# Altium schematic sheet ArduinoUnoQ.SchDoc
size A4; SheetNumber: 1; SheetTotal: 1
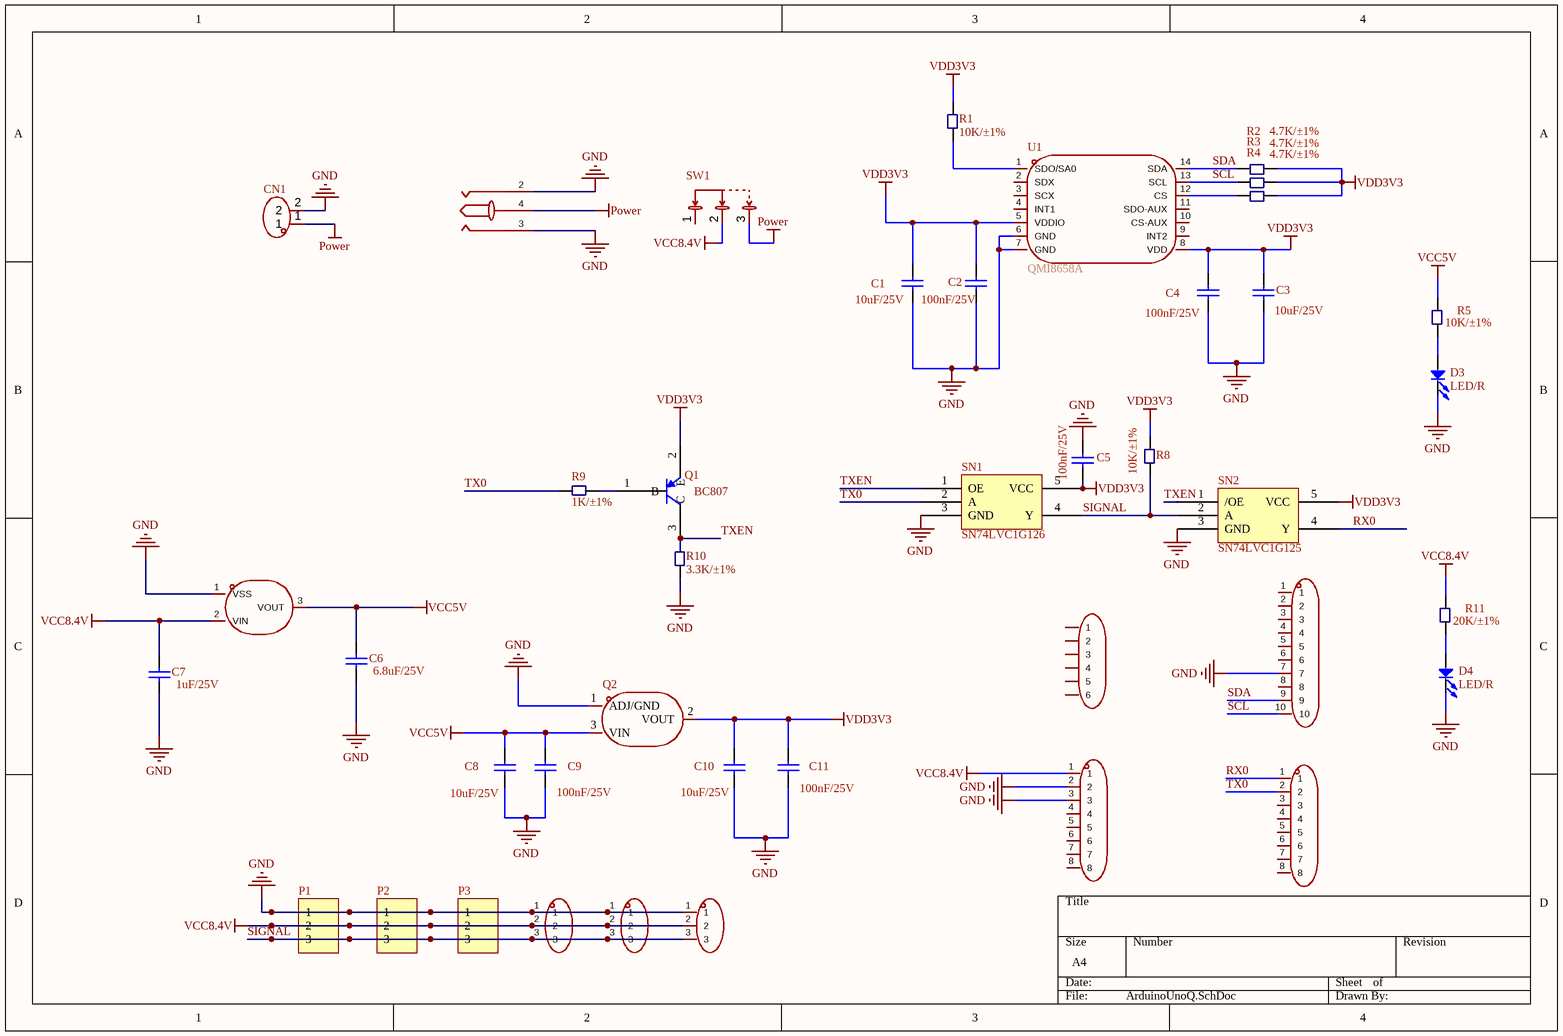
[diagram p0: ArduinoUnoQ.SchDoc]

## Parts
C1  10uF/25V  [C0603]
C2  100nF/25V  [C0603]
C3  10uF/25V  [C0603]
C4  100nF/25V  [C0603]
C5  100nF/25V  [C0603]
C6  6.8uF/25V  [C0603]
C7  1uF/25V  [C0603]
C8  10uF/25V  [C0603]
C9  100nF/25V  [C0603]
C10  10uF/25V  [C0603]
C11  100nF/25V  [C0603]
CN1  ZX-XH2.54-2PWZ  [CONN-TH_2P-P2.50_ZX-XH2.54-2PWZ]  (value not drawn)
D3  LED/R  [D_SOD_523]
D4  LED/R  [D_SOD_523]
DC1  kh-dc-007b-2.1g  [DC-IN-TH_KH-DC-007B-2.1G]  (value not drawn)
H1  pz254v-11-06p  [HDR-TH_6P-P2.54-V-M-1]  (value not drawn)
H2  pz254v-11-10p  [HDR-TH_10P-P2.54-V-M]  (value not drawn)
H3  pz254v-11-08p  [HDR-TH_8P-P2.54-V-M]  (value not drawn)
H4  pz254v-11-08p  [HDR-TH_8P-P2.54-V-M]  (value not drawn)
P1  Header 3  [MX 1.25-WI-3P]  (value not drawn)
P2  Header 3  [MX 1.25-WI-3P]  (value not drawn)
P3  Header 3  [MX 1.25-WI-3P]  (value not drawn)
Q1  BC807  [SOT-23-3]
Q2  AMS1117-3.3V  [SOT-89-3_L4.5-W2.5-P1.50-LS4.2-BR]  (value not drawn)
R1  10K/±1%  [R0603]
R2  4.7K/±1%  [R0603]
R3  4.7K/±1%  [R0603]
R4  4.7K/±1%  [R0603]
R5  10K/±1%  [R0603]
R8  10K/±1%  [R0603]
R9  1K/±1%  [R0603]
R10  3.3K/±1%  [R0603]
R11  20K/±1%  [R0603]
SN1  SN74LVC1G126  [SOT_23_5]
SN2  SN74LVC1G125  [SOT_23_5]
SW1  SS-12D06L5  [SW-TH_3P-P4.70_L11.1-W12.7]  (value not drawn)
U1  QMI8658A  [LGA-14_L3.0-W2.5-P0.50-TL]
U2  h7651-50pr  [SOT-89-3_L4.5-W2.5-P1.50-LS4.2-BR]  (value not drawn)
U3  292253-3  [CONN-TH_3P-P2.00_TE_292253-3]  (value not drawn)
U4  292253-3  [CONN-TH_3P-P2.00_TE_292253-3]  (value not drawn)
U5  292253-3  [CONN-TH_3P-P2.00_TE_292253-3]  (value not drawn)

## Nets
GND: C1.1 C2.1 C3.1 C4.1 C5.2 C6.1 C7.1 C8.1 C9.1 C10.1 C11.1 CN1.2 D3.2(K) D4.2(K) DC1.2 DC1.3 H2.7 H3.2 H3.3 P1.1 P2.1 P3.1 Q2.1(ADJ/GND) R10.2 SN1.3(GND) SN2.3(GND) U1.6(GND) U1.7(GND) U2.1(VSS) U3.1 U4.1 U5.1
Power: CN1.1 DC1.4 SW1.3
VCC5V: C6.2 C8.2 C9.2 Q2.3(VIN) R5.1 U2.3(VOUT)
VCC8.4V: C7.2 H3.1 P1.2 P2.2 P3.2 R11.1 SW1.2 U2.2(VIN) U3.2 U4.2 U5.2
VDD3V3: C1.2 C2.2 C3.2 C4.2 C5.1 C10.2 C11.2 Q1.2(E) Q2.2(VOUT) R1.1 R2.2 R3.2 R4.2 R8.1 SN1.5(VCC) SN2.5(VCC) U1.5(VDDIO) U1.8(VDD)
RX0: H4.1 SN2.4(Y)
SCL: H2.10 R3.1 U1.13(SCL)
SDA: H2.9 R2.1 U1.14(SDA)
SIGNAL: P1.3 P2.3 P3.3 R8.2 SN1.4(Y) SN2.2(A) U3.3 U4.3 U5.3
TX0: H4.2 R9.2 SN1.2(A)
TXEN: Q1.3(C) R10.1 SN1.1(OE) SN2.1(/OE)
NetD3_1: D3.1(A) R5.2
NetD4_1: D4.1(A) R11.2
NetQ1_1: Q1.1(B) R9.1
NetR1_2: R1.2 U1.1(SDO/SA0)
NetR4_1: R4.1 U1.12(CS)

Not connected (* = marked no-connect by the designer): H1 1 2 3 4 5 6; H2 1 2 3 4 5 6 8; H3 4 5 6 7 8; H4 3 4 5 6 7 8; SW1 1; U1 2(SDX) 3(SCX) 4(INT1) 9(INT2) 10(CS-AUX) 11(SDO-AUX)

## Library data of the parts
C1-C4 C6-C11 = 0603 C: 0603贴片电容，±10%，50V; Published: 8-Jun-2000; LatestRevisionDate: 17-Jul-2002; LatestRevisionNote: Re-released for DXP Platform.; PackageReference: RAD-0.3; Publisher: Altium Limited; PackageDescription: Radial Cap, Thru-Hole; 2 Leads; 0.3 in Pin Spacing
  C1 C3 C8 C10: Value: 10uF/25V
  C2 C4 C9 C11: Value: 100nF/25V
  C6: Value: 6.8uF/25V
  C7: Value: 1uF/25V
C5 = 0603 10nF (103) 10% 50V: 贴片电容; ComponentLink1Description: 供应商链接; ComponentLink1URL: http://www.szlcsc.com/product/details_58143.html; Package: 0603; Supplier: LC; SuppliersPartNumber: C57112
CN1 = ZX-XH2.54-2PWZ: 插针结构:1x2P;间距:2.5mm;安装方式:弯插;参考系列:XH;总PIN数:2P;排数:1;每排PIN数:2;行距:-;额定电流:2A;触头材质:黄铜;触头镀层:锡;工作温度:-25℃~+85℃;; Manufacturer: Megastar(兆星); AddInBom: yes; ModelId: 24f25f0d7a3348c685f49f501f04732c聨0819f05c4eef4c71ace90d822a990e87; ModelTransform: 295.669,300.7868,0,0,0,0,0,-137.795,-133.858; Pins Structure: 1x2P; Pitch: 2.5mm; Reference Series: XH; Number of PINs Per Row: 2; Current Rating: 2A; Voltage Rating: 250V; Plastic Material: PA66; Flame Retardant Rating: UL94V-0; Z-Height of the Board: 5.9mm; X-Length of Bottom Edge on Board (Spacing Line): 7.5mm; Y-Width of Bottom Edge on Board: 7.32mm; Symbol: ZX-XH2.54-2PWZ; Device: ZX-XH2.54-2PWZ; LCSC Part Name: 1x2P 间距:2.5mm 弯插 系列:XH; SupplierPart: C7429641; ManufacturerPart: ZX-XH2.54-2PWZ; Supplier Footprint: 弯插,P=2.5mm; JLCPCB Part Class: Extended Part; Datasheet: https://item.szlcsc.com/datasheet/ZX-XH2.54-2PWZ/8427558.html; Supplier: LCSC; ConvertToPcb: yes; FootprintName: CONN-TH_2P-P2.50_ZX-XH2.54-2PWZ; ModelName: CONN-TH_2P-P2.50_ZX-XH2.54-2PWZ; Mounting Type: 弯插; Number of Pins: 2P; Number of Rows: 1; Row Spacing: -; Contact Material: 黄铜; Contact Plating: 锡; Operating Temperature: -25℃~+85℃; Supplementary Features: -; Color: 白色
D3 D4 = LED: Typical INFRARED GaAs LED; Published: 8-Jun-2000; LatestRevisionDate: 08-Jul-2005; LatestRevisionNote: Mech Layer 1 removed.; PackageReference: LED-0; Publisher: Altium Limited; PackageDescription: LED; 2 Leads
DC1 = kh-dc-007b-2.1g: 连接器类型:DC电源插座;安装方式:弯插;触点内径:-;触点外径:-;额定电流:3A;额定电压:50V;工作温度:-30℃~+70℃;; Manufacturer: kinghelm(金航标); AddInBom: yes; ModelId: db467a4a132a497c9fa96d37cafb49be; ModelTransform: 511.81,393.7,0,270,0,0,0,90.551,-74.803; Connector Type: DC电源插座; Current Rating: 3A; Voltage Rating (Max): 50V; Body Height: 10mm; Symbol: KH-DC-007B-2.1G; LCSC Part Name: DC电源插座; SupplierPart: C2847175; ManufacturerPart: KH-DC-007B-2.1G; Supplier Footprint: 插件; JLCPCB Part Class: Extended Part; Datasheet: https://item.szlcsc.com/datasheet/KH-DC-007B-2.1G/3043197.html; Supplier: LCSC; ConvertToPcb: yes; FootprintName: DC-IN-TH_KH-DC-007B-2.1G; ModelName: DC-IN-TH_KH-DC-007B-2.1G; Mounting Type: 弯插; Inside Contact Diameter: -; Outside Contact Diameter: -; Length: 13mm; Width: 10.85mm; Operating Temperature: -30℃~+70℃
H1 = pz254v-11-06p: 插针结构:1x6P;间距:2.54mm;行距:-;圆针/方针:方针;安装方式:直插;排数:单排;总PIN位数:6P;额定电流:3A;额定电压:-;配合针长度:6mm;塑高:2.5mm;端接针长度:3mm;触头材质:黄铜;触头镀层:金;工作温度:-40℃~+105℃;颜色:黑色;; Manufacturer: BOOMELE(博穆精密); ManufacturerPart: 2.54-1x6P直针; Symbol: Header-Male-2.54_1x6; AddInBom: yes; ModelId: 60739dffc9b04830a286435b0fefbd4a; ModelName: HDR2.54-M-LI-1X6P; ModelTransform: 599.999,100,0,0,0,0,0,0,-118.11; Pin Structure: 1x6P; Pitch: 2.54mm; Circluar Pins/Square Pins: 方针; Current Rating: 3A; LCSC Part Name: 1x6P 间距:2.54mm 方针 直插; SupplierPart: C37208; Supplier Footprint: 插件,P=2.54mm; JLCPCB Part Class: Extended Part; Datasheet: https://item.szlcsc.com/datasheet/2.54-1x6P%25E7%259B%25B4%25E9%2592%2588/38187.html; Supplier: LCSC; ConvertToPcb: yes; FootprintName: HDR-TH_6P-P2.54-V-M-1; Row Spacing: -; Mounting Type: 直插; Number of Rows: 单排; Number of Pins: 6P; Voltage Rating (Max): -; Length of Mating Pin: 6mm; Insulation Height: 2.5mm; Length of End Connection Pin: 3mm; Contact Material: 黄铜; Contact Plating: 金; Operating Temperature: -40℃~+105℃; Color: 黑色
H2 = pz254v-11-10p: 插针结构:1x10P;间距:2.54mm;行距:-;圆针/方针:方针;安装方式:直插;排数:单排;总PIN位数:10P;额定电流:3A;额定电压:250V;配合针长度:6mm;塑高:2.5mm;端接针长度:3mm;触头材质:黄铜;触头镀层:-;工作温度:-40℃~+105℃;颜色:黑色;; Manufacturer: XFCN(兴飞); AddInBom: yes; ModelId: 10f3d1cea59e4bb4ba116af9f09c2b9b; ModelName: HDR2.54-M-LI-1X10P; ModelTransform: 999.99796,100,0,0,0,0,0,0,-118.11; Pin Structure: 1x10P; Pitch: 2.54mm; Circluar Pins/Square Pins: 方针; Current Rating: 3A; Voltage Rating (Max): 250V; Symbol: PZ254V-11-10P; LCSC Part Name: 1x10P 间距:2.54mm 方针 直插; SupplierPart: C492409; ManufacturerPart: PZ254V-11-10P; Supplier Footprint: 插件,P=2.54mm; JLCPCB Part Class: Extended Part; Datasheet: https://item.szlcsc.com/datasheet/PZ254V-11-10P/502965.html; Supplier: LCSC; ConvertToPcb: yes; FootprintName: HDR-TH_10P-P2.54-V-M; Row Spacing: -; Mounting Type: 直插; Number of Rows: 单排; Number of Pins: 10P; Length of Mating Pin: 6mm; Insulation Height: 2.5mm; Length of End Connection Pin: 3mm; Contact Material: 黄铜; Contact Plating: -; Operating Temperature: -40℃~+105℃; Color: 黑色
H3 H4 = pz254v-11-08p: 插针结构:1x8P;间距:2.54mm;行距:-;圆针/方针:方针;安装方式:直插;排数:单排;总PIN位数:8P;额定电流:3A;额定电压:250V;配合针长度:6mm;塑高:2.5mm;端接针长度:3mm;触头材质:黄铜;触头镀层:-;工作温度:-40℃~+105℃;颜色:黑色;; Manufacturer: XFCN(兴飞); AddInBom: yes; ModelId: f5b96e27511e49e38545e53df2320202; ModelTransform: 807.87244,98.425,0,0,0,0,0,0,-118.11; Pin Structure: 1x8P; Pitch: 2.54mm; Circluar Pins/Square Pins: 方针; Current Rating: 3A; Voltage Rating (Max): 250V; Symbol: PZ254V-11-08P; LCSC Part Name: 1x8P 间距:2.54mm 方针 直插; SupplierPart: C492407; ManufacturerPart: PZ254V-11-08P; Supplier Footprint: 插件,P=2.54mm; JLCPCB Part Class: Extended Part; Datasheet: https://item.szlcsc.com/datasheet/PZ254V-11-08P/502963.html; Supplier: LCSC; ConvertToPcb: yes; FootprintName: HDR-TH_8P-P2.54-V-M; ModelName: HDR-TH_8P-P2.54-V-M; Row Spacing: -; Mounting Type: 直插; Number of Rows: 单排; Number of Pins: 8P; Length of Mating Pin: 6mm; Insulation Height: 2.5mm; Length of End Connection Pin: 3mm; Contact Material: 黄铜; Contact Plating: -; Operating Temperature: -40℃~+105℃; Color: 黑色
P1-P3 = Header 3: Header, 3-Pin; LatestRevisionDate: 17-Jul-2002; LatestRevisionNote: Re-released for DXP Platform.; Publisher: Altium Limited
Q1 = PNP 60V 600mA: 三极管BJT; Published: 8-Jun-2000; LatestRevisionDate: 15-Jan-2003; LatestRevisionNote: PCB Footprint 'BCY-W3/D4.7' replaced; DatasheetVersion: 1997; PackageVersion: Sep-1998; PackageReference: TO-92A; Publisher: Altium Limited; PackageDescription: TO, Flat Index; 3 In-Line, Axial Leads; Body Dia. 4.5mm; Leads 0.51 x 0.48 mm (max); ComponentLink1Description: Manufacturer Link; ComponentLink1URL: http://www.fairchildsemi.com/; ComponentLink2Description: Datasheet; ComponentLink2URL: http://www.fairchildsemi.com/ds/2N%2F2N3906.pdf
Q2 = AMS1117-3.3V_SOT89: 输入18V 输出3.3V 1A，SOT-89封装; Manufacturer: MSKSEMI(美森科); Symbol: AMS1117-3.3V_C5120796; Add into BOM: yes; Output Type: 固定; Voltage - Supply: 18V; Output Voltage: 3.3V; Output Current: 1A; Voltage Dropout: 1.4V@(1A); standby current: 12mA; Output Configuration: 正极; Number of Outputs: 1; Device: AMS1117-3.3V_C5120796; LCSC Part Name: 输入18V 输出3.3V 1A; Supplier Part: C5120796; Manufacturer Part: AMS1117-3.3V; Supplier Footprint: SOT-89; JLCPCB Part Class: Extended Part; Datasheet: https://atta.szlcsc.com/upload/public/pdf/source/20240731/7960C38D2F7D4AC8FF3CFA386029A4C5.pdf; Supplier: LCSC; Convert to PCB: yes; Operating Temperature: 0℃~+125℃
R1-R5 R8-R11 = Res2_1: Resistor; Published: 8-Jun-2000; LatestRevisionDate: 17-Jul-2002; LatestRevisionNote: Re-released for DXP Platform.; PackageReference: AXIAL-0.4; Publisher: Altium Limited
SN1 = SN74LVC1G126: 输出缓冲器
SW1 = SS-12D06L5: 电路结构:单刀双掷;安装方式:-;开关颜色:黑色;额定电流:3A;额定电压:125V;工作寿命:1万次;; Manufacturer: XKB Connection(中国星坤); AddInBom: yes; ModelId: cdc951e5f4794e0cacc9ea6ffda3ed7a聨0819f05c4eef4c71ace90d822a990e87; ModelTransform: 509.842,582.67596,0,0,0,0,0,-265.748,-145.669; Circuit: 单刀双掷; Actuator Style: 矩形柱状; Switch Height: 6.3mm; Actuator Color: 黑色; Current Rating: 3A; Voltage Rating: 125V; Life: 1万次; Symbol: SS-12D06L5; Device: SS-12D06L5; LCSC Part Name: 柄长5mm 卧插双档 滑动开关; SupplierPart: C319015; ManufacturerPart: SS-12D06L5; Supplier Footprint: 插件,13x6.6mm; JLCPCB Part Class: Extended Part; Supplier: LCSC; ConvertToPcb: yes; FootprintName: SW-TH_3P-P4.70_L11.1-W12.7; ModelName: SW-TH_3P-P4.70_L11.1-W12.7; Termination Style: PC引脚; Length: 12.95mm; Width: 6.6mm; Mounting Type: -; Operating Temperature: -40℃~+85℃
U1 = QMI8658A: 六轴陀螺仪  陀螺仪量程(MAX) ±2048dps  加速度计量程(MAX) ±16g; Symbol: QMI8658A_C3021082
U2 = h7651-50pr: 输出极性:正极;工作电压:8.5V;输出电压:5V;输出电流:1A;电源纹波抑制比(PSRR):-;输出类型:固定;; Manufacturer: Siproin(上海矽朋); AddInBom: yes; ModelId: 6db690b7897d4d18a30d90c1b89525ee; ModelName: SOT-89-3_L4.3-W2.5-H1.6-LS4.1-P1.50; ModelTransform: 161.417,169.291,0,180,0,0,-18.661,0,0; Output Configuration: 正极; Voltage - Supply: 8.5V; Output Voltage: 5V; Output Current: 1A; Voltage Dropout: 50mV@(100mA); standby current: 2uA; Output Type: 固定; Number of Outputs: 1; Symbol: H7651-50PR; LCSC Part Name: 5V 1A 8.5V; SupplierPart: C411051; ManufacturerPart: H7651-50PR; Supplier Footprint: SOT-89-3; JLCPCB Part Class: Extended Part; Datasheet: https://item.szlcsc.com/datasheet/H7651-50PR/402216.html; Supplier: LCSC; ConvertToPcb: yes; FootprintName: SOT-89-3_L4.5-W2.5-P1.50-LS4.2-BR; Power Supply Rejection Ratio (PSRR): -; Noise: -; Features: 热关断; Operating Temperature: -40℃~+85℃
U3-U5 = 292253-3: 插针结构:1x3P;间距:2mm;安装方式:弯插;总PIN数:3P;排数:1;每排PIN数:3;额定电流:4A;触头材质:黄铜;触头镀层:锡;工作温度:-40℃~+105℃;; Manufacturer: TE Connectivity(泰科电子); AddInBom: yes; ModelId: a9520a19719f44d590017de8a7a53ae9; ModelTransform: 307.086,346.456,0,0,0,0,-11.81,-106.299,-125.984; Pins Structure: 1x3P; Pitch: 2mm; Number of PINs Per Row: 3; Current Rating: 4A; Voltage Rating: 125V; Plastic Material: PA66; Flame Retardant Rating: UL94V-0; Z-Height of the Board: 4mm; X-Length of Bottom Edge on Board (Spacing Line): 7.8mm; Y-Width of Bottom Edge on Board: 8.8mm; Symbol: 292253-3; LCSC Part Name: 1x3P 间距:2mm 弯插; SupplierPart: C532003; ManufacturerPart: 292253-3; Supplier Footprint: 弯插,P=2mm; JLCPCB Part Class: Extended Part; Datasheet: https://item.szlcsc.com/datasheet/292253-3/552164.html; Supplier: LCSC; ConvertToPcb: yes; FootprintName: CONN-TH_3P-P2.00_TE_292253-3; ModelName: CONN-TH_3P-P2.00_TE_292253-3; Mounting Type: 弯插; Number of Pins: 3P; Number of Rows: 1; Contact Material: 黄铜; Contact Plating: 锡; Operating Temperature: -40℃~+105℃